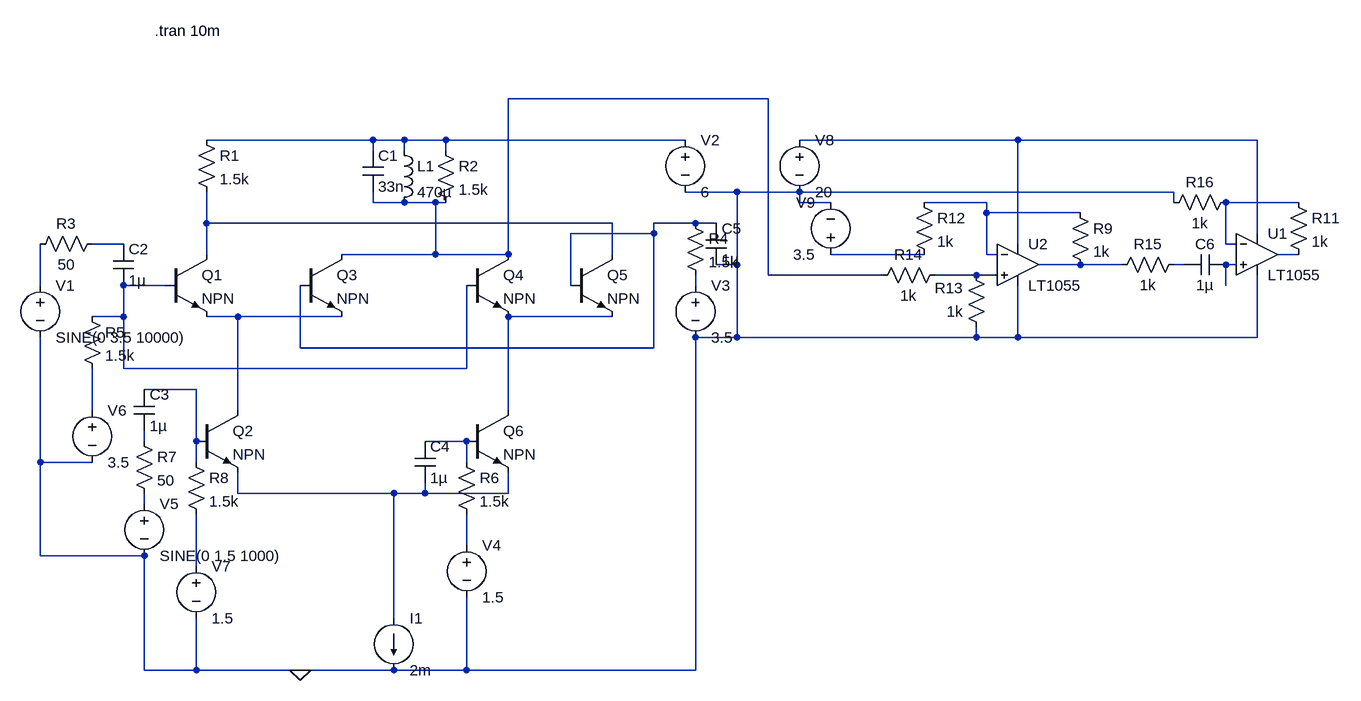
[diagram p0: schematic amModulator_V1.asc]
amModulator_V1.asc, the LTspice schematic file:
Version 4
SHEET 1 1716 832
WIRE 800 -64 400 -64
WIRE 192 0 -64 0
WIRE 240 0 192 0
WIRE 304 0 240 0
WIRE 672 0 304 0
WIRE 1184 0 848 0
WIRE 1552 0 1184 0
WIRE 192 16 192 0
WIRE 240 16 240 0
WIRE 304 16 304 0
WIRE 752 80 672 80
WIRE 848 80 752 80
WIRE 1424 80 848 80
WIRE 192 96 192 80
WIRE 240 96 192 96
WIRE 288 96 240 96
WIRE 304 96 288 96
WIRE 848 96 848 80
WIRE 896 96 848 96
WIRE 1136 96 1040 96
WIRE 1424 96 1424 80
WIRE 1616 96 1504 96
WIRE 1136 112 1136 96
WIRE 1280 112 1136 112
WIRE -64 128 -64 80
WIRE 560 128 -64 128
WIRE 688 128 624 128
WIRE 720 128 688 128
WIRE 624 144 624 128
WIRE 624 144 496 144
WIRE 1552 144 1552 0
WIRE -192 160 -240 160
WIRE 1184 160 1184 0
WIRE 1504 160 1504 96
WIRE 1520 160 1504 160
WIRE -64 176 -64 128
WIRE 288 176 288 96
WIRE 288 176 144 176
WIRE 400 176 400 -64
WIRE 400 176 288 176
WIRE 560 176 560 128
WIRE 1040 176 896 176
WIRE 1136 176 1136 112
WIRE 1152 176 1136 176
WIRE 1616 176 1584 176
WIRE 752 192 752 80
WIRE 752 192 720 192
WIRE 1280 192 1216 192
WIRE 1344 192 1280 192
WIRE 1440 192 1424 192
WIRE 1520 192 1504 192
WIRE 800 208 800 -64
WIRE 976 208 800 208
WIRE 1120 208 1056 208
WIRE 1152 208 1120 208
WIRE -320 224 -320 160
WIRE -128 224 -192 224
WIRE 496 224 496 144
WIRE 688 224 688 208
WIRE 1504 224 1504 192
WIRE -192 272 -192 224
WIRE -192 272 -240 272
WIRE -16 272 -64 272
WIRE 144 272 -16 272
WIRE 560 272 400 272
WIRE 752 304 752 192
WIRE 752 304 688 304
WIRE 1120 304 1120 288
WIRE 1120 304 752 304
WIRE 1184 304 1184 224
WIRE 1184 304 1120 304
WIRE 1552 304 1552 208
WIRE 1552 304 1184 304
WIRE 80 320 80 224
WIRE 624 320 624 144
WIRE 624 320 80 320
WIRE -192 352 -192 272
WIRE 336 352 336 224
WIRE 336 352 -192 352
WIRE -80 384 -160 384
WIRE -240 416 -240 352
WIRE -16 416 -16 272
WIRE 400 416 400 272
WIRE -160 464 -160 448
WIRE -80 464 -80 384
WIRE 336 464 272 464
WIRE -320 496 -320 304
WIRE -240 496 -320 496
WIRE -80 496 -80 464
WIRE 336 496 336 464
WIRE -16 544 -16 512
WIRE 224 544 -16 544
WIRE 272 544 272 528
WIRE 272 544 224 544
WIRE 400 544 400 512
WIRE 400 544 272 544
WIRE -160 560 -160 544
WIRE 336 624 336 576
WIRE -320 640 -320 496
WIRE -160 640 -320 640
WIRE -80 656 -80 576
WIRE 224 736 224 544
WIRE -160 816 -160 640
WIRE -80 816 -80 736
WIRE -80 816 -160 816
WIRE 80 816 -80 816
WIRE 224 816 80 816
WIRE 336 816 336 704
WIRE 336 816 224 816
WIRE 688 816 688 304
WIRE 688 816 336 816
FLAG 80 816 0
SYMBOL voltage -320 208 R0
SYMATTR InstName V1
SYMATTR Value SINE(0 3.5 10000)
SYMBOL npn -128 176 R0
SYMATTR InstName Q1
SYMBOL npn -80 416 R0
SYMATTR InstName Q2
SYMBOL npn 80 176 R0
SYMATTR InstName Q3
SYMBOL npn 336 176 R0
SYMATTR InstName Q4
SYMBOL npn 496 176 R0
SYMATTR InstName Q5
SYMBOL npn 336 416 R0
SYMATTR InstName Q6
SYMBOL res -80 -16 R0
SYMATTR InstName R1
SYMATTR Value 1.5k
SYMBOL voltage 672 -16 R0
SYMATTR InstName V2
SYMATTR Value 6
SYMBOL voltage 688 208 R0
SYMATTR InstName V3
SYMATTR Value 3.5
SYMBOL voltage 336 608 R0
SYMATTR InstName V4
SYMATTR Value 1.5
SYMBOL voltage -160 544 R0
SYMATTR InstName V5
SYMATTR Value SINE(0 1.5 1000)
SYMBOL current 224 736 R0
SYMATTR InstName I1
SYMATTR Value 2m
SYMBOL cap 176 16 R0
SYMATTR InstName C1
SYMATTR Value 33n
SYMBOL ind 224 0 R0
SYMATTR InstName L1
SYMATTR Value 470µ
SYMBOL res 288 0 R0
SYMATTR InstName R2
SYMATTR Value 1.5k
SYMBOL res -224 144 R90
WINDOW 0 0 56 VBottom 2
WINDOW 3 32 56 VTop 2
SYMATTR InstName R3
SYMATTR Value 50
SYMBOL cap -208 160 R0
SYMATTR InstName C2
SYMATTR Value 1µ
SYMBOL res 672 112 R0
SYMATTR InstName R4
SYMATTR Value 1.5k
SYMBOL voltage -240 400 R0
SYMATTR InstName V6
SYMATTR Value 3.5
SYMBOL res -256 256 R0
SYMATTR InstName R5
SYMATTR Value 1.5k
SYMBOL res 320 480 R0
SYMATTR InstName R6
SYMATTR Value 1.5k
SYMBOL res -176 448 R0
SYMATTR InstName R7
SYMATTR Value 50
SYMBOL cap -176 384 R0
SYMATTR InstName C3
SYMATTR Value 1µ
SYMBOL res -96 480 R0
SYMATTR InstName R8
SYMATTR Value 1.5k
SYMBOL voltage -80 640 R0
SYMATTR InstName V7
SYMATTR Value 1.5
SYMBOL cap 256 464 R0
SYMATTR InstName C4
SYMATTR Value 1µ
SYMBOL cap 704 128 R0
SYMATTR InstName C5
SYMATTR Value 1µ
SYMBOL res 1264 96 R0
SYMATTR InstName R9
SYMATTR Value 1k
SYMBOL voltage 848 -16 R0
SYMATTR InstName V8
SYMATTR Value 20
SYMBOL Opamps/LT1055 1184 128 R0
SYMATTR InstName U2
SYMBOL res 1024 80 R0
SYMATTR InstName R12
SYMATTR Value 1k
SYMBOL res 1136 304 R180
WINDOW 0 36 76 Left 2
WINDOW 3 36 40 Left 2
SYMATTR InstName R13
SYMATTR Value 1k
SYMBOL res 960 224 R270
WINDOW 0 32 56 VTop 2
WINDOW 3 0 56 VBottom 2
SYMATTR InstName R14
SYMATTR Value 1k
SYMBOL voltage 896 192 R180
WINDOW 0 24 96 Left 2
WINDOW 3 24 16 Left 2
SYMATTR InstName V9
SYMATTR Value 3.5
SYMBOL res 1328 208 R270
WINDOW 0 32 56 VTop 2
WINDOW 3 0 56 VBottom 2
SYMATTR InstName R15
SYMATTR Value 1k
SYMBOL Opamps/LT1055 1552 112 R0
SYMATTR InstName U1
SYMBOL cap 1504 176 R90
WINDOW 0 0 32 VBottom 2
WINDOW 3 32 32 VTop 2
SYMATTR InstName C6
SYMATTR Value 1µ
SYMBOL res 1600 80 R0
SYMATTR InstName R11
SYMATTR Value 1k
SYMBOL res 1520 80 R90
WINDOW 0 0 56 VBottom 2
WINDOW 3 32 56 VTop 2
SYMATTR InstName R16
SYMATTR Value 1k
TEXT -144 -168 Left 2 !.tran 10m

The netlist it stands for:
* amModulator_V1.asc
V1 N015 0 SINE(0 3.5 10000)
Q1 N006 N016 N018 0 NPN
Q2 N018 N020 N024 0 NPN
Q3 N001 N007 N018 0 NPN
Q4 N001 N016 N019 0 NPN
Q5 N006 N007 N019 0 NPN
Q6 N019 N023 N024 0 NPN
R1 N002 N006 1.5k
V2 N002 0 6
V3 N017 0 3.5
V4 N026 0 1.5
V5 N025 0 SINE(0 1.5 1000)
I1 N024 0 2m
C1 N002 N001 33n
L1 N002 N001 470µ
R2 N002 N001 1.5k
R3 N008 N015 50
C2 N008 N016 1µ
R4 N007 N017 1.5k
V6 N021 0 3.5
R5 N016 N021 1.5k
R6 N023 N026 1.5k
R7 N022 N025 50
C3 N020 N022 1µ
R8 N020 N027 1.5k
V7 N027 0 1.5
C4 N023 N024 1µ
C5 N007 0 1µ
R9 N004 N011 1k
V8 N003 0 20
XU2 N014 N004 N003 0 N011 LT1055  ; pins In+ In- V+ V- OUT
R12 N004 N009 1k
R13 0 N014 1k
R14 N001 N014 1k
V9 N009 0 3.5
R15 N011 N012 1k
XU1 N013 N005 N003 0 N010 LT1055  ; pins In+ In- V+ V- OUT
C6 N013 N012 1µ
R11 N005 N010 1k
R16 N005 0 1k
.model NPN NPN
.model PNP PNP
.lib standard.bjt
.tran 10m
.backanno
.end